# Altium project SensorBoard.PrjPcb
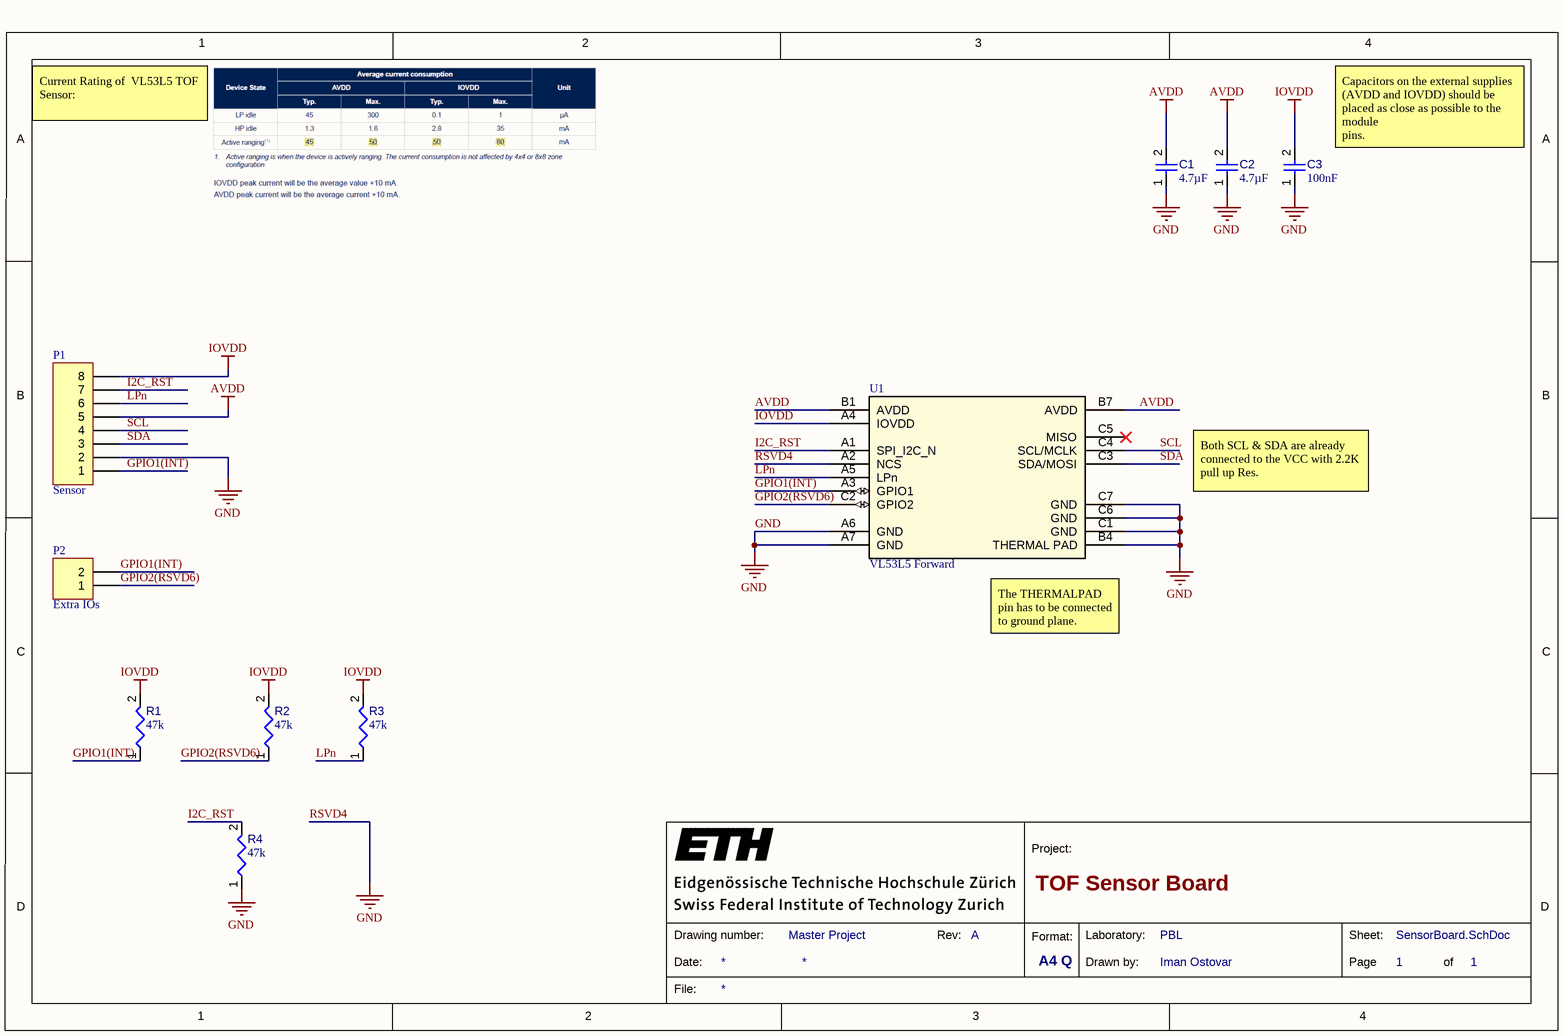
[diagram p0: SensorBoard.SchDoc]
1 sheet, 10 parts. Net scope: global (net labels, ports and power ports of the same name join across sheets).
Board file: SensorPCB.PcbDoc

## Sheet SensorBoard.SchDoc: TOF Sensor Board
size A4; Author: Iman Ostovar; CompanyName: ETH Zürich; DrawnBy: Iman Ostovar; Engineer: Iman Ostovar; Organization: PBL; DocumentNumber: Master Project; Revision: A; SheetNumber: 1; SheetTotal: 1; Project: Sensor Shield for Drone

### Parts
C1  value 4.7µF  [CAPC1005X55X25ML5T10]  (hidden comment: Capacitor 1 uF +/- 10% 6.3 V 1005)
C2  value 4.7µF  [CAPC1005X55X25ML5T10]  (hidden comment: Capacitor 1 uF +/- 10% 6.3 V 1005)
C3  value 100nF  [CAPC0402(1005)60_L]  (hidden comment: Capacitor 100nF +/-20% 25V 0402)
P1  Sensor  [MHDR1X8]
P2  Extra IOs  [MHDR1X2]
R1  value 47k  [RESC0402(1005)_L]  (hidden comment: Resistor 47K5 +/-1 % 0402 63 mW)
R2  value 47k  [RESC0402(1005)_L]  (hidden comment: Resistor 47K5 +/-1 % 0402 63 mW)
R3  value 47k  [RESC0402(1005)_L]  (hidden comment: Resistor 47K5 +/-1 % 0402 63 mW)
R4  value 47k  [RESC0402(1005)_L]  (hidden comment: Resistor 47K5 +/-1 % 0402 63 mW)
U1  VL53L5 Forward  [ARRAY_53L5_STM]

### Nets
AVDD: C1.2 C2.2 P1.5 U1.B1(AVDD) U1.B7(AVDD)
GND: C1.1 C2.1 C3.1 P1.2 R4.1 U1.A2(NCS) U1.A6(GND) U1.A7(GND) U1.B4(THERMAL_PAD) U1.C1(GND) U1.C6(GND) U1.C7(GND)  [also labelled RSVD4]
IOVDD: C3.2 P1.8 R1.2 R2.2 R3.2 U1.A4(IOVDD)
GPIO1(INT): P1.1 P2.2 R1.1 U1.A3(GPIO1)
GPIO2(RSVD6): P2.1 R2.1 U1.C2(GPIO2)
I2C_RST: P1.7 R4.2 U1.A1(SPI_I2C_N)
LPn: P1.6 R3.1 U1.A5(LPn)
SCL: P1.4 U1.C4(SCL/MCLK)
SDA: P1.3 U1.C3(SDA/MOSI)

Not connected (* = marked no-connect by the designer): U1 C5(MISO)*

### Notes on the sheet
- Current Rating of  VL53L5 TOF Sensor:
- (near C3) Capacitors on the external supplies (AVDD and IOVDD) should be placed as close as possible to the module
  pins.
- Both SCL & SDA are already connected to the VCC with 2.2K pull up Res.
- (near U1) The THERMALPAD pin has to be connected to ground plane.
- 1
- 2
- 3
- 4
- A
- B
- C
- Project:
- D
- Date:
- Drawing number:
- Rev:
- Format:
- A4 Q
- Drawn by:
- Laboratory:
- Page
- Sheet:
- of
- File:

### Library data of the parts
C1 C2 = CMP-001-00009-6: Chip Capacitor, 1 uF, +/- 10%, 6.3 V, 1005 (0402 Metric); Voltage Rating: 6.3V; Capacitor Type: Ceramic; Min Operating Temperature: -55°C; Case/Package: 0402; Tolerance: 10%; Mounting Technology: SM; Max Operating Temperature: 85°C; RoHS Compliant: True; Pins: 2
C3 = CMP-001-00065-4: Chip Capacitor, 100nF +/-20%, 25V, 0402, Thickness 0.6 mm; Tolerance: 10%; Max Operating Temperature: 85°C; Min Operating Temperature: -55°C; Pins: 2; Voltage Rating: 25V; Mounting Technology: SMT; Case/Package: 0402
P1 = MHDR1X8: Header, 8-Pin; System: Connector; LatestRevisionDate: 17-Jul-2002; LatestRevisionNote: Re-released for DXP Platform.; Publisher: Altium Limited
P2 = MHDR1X2: Header, 2-Pin; LatestRevisionDate: 17-Jul-2002; LatestRevisionNote: Re-released for DXP Platform.; Publisher: Altium Limited
R1-R4 = CMP-009-00137-3: Chip Resistor, 47,5 kOhms, +/-1 %, 63 mW, -55 to 155 degC, 0402; Power: 63mW; Tolerance: 1%; Pins: 2; Case/Package: 0402; Min Operating Temperature: -55°C; Max Operating Temperature: 155°C
U1 = VL53L5: No Description Available; Built_By: EMA_Matt; Vendor: STMicroelectronics; SourceLibrary: Update_to_database_2021-02-23; Datasheet: https://www.st.com/resource/en/data_brief/vl53l5.pdf; Copyright: Copyright (C) 2018 Accelerated Designs. All rights reserved; Manufacturer_Part_Number: VL53L5; RefDes: RefDes; Type: DEV